# Altium schematic sheet 0_1_RevHis.SchDoc: Revision History
size A3; SheetNumber: 0.1
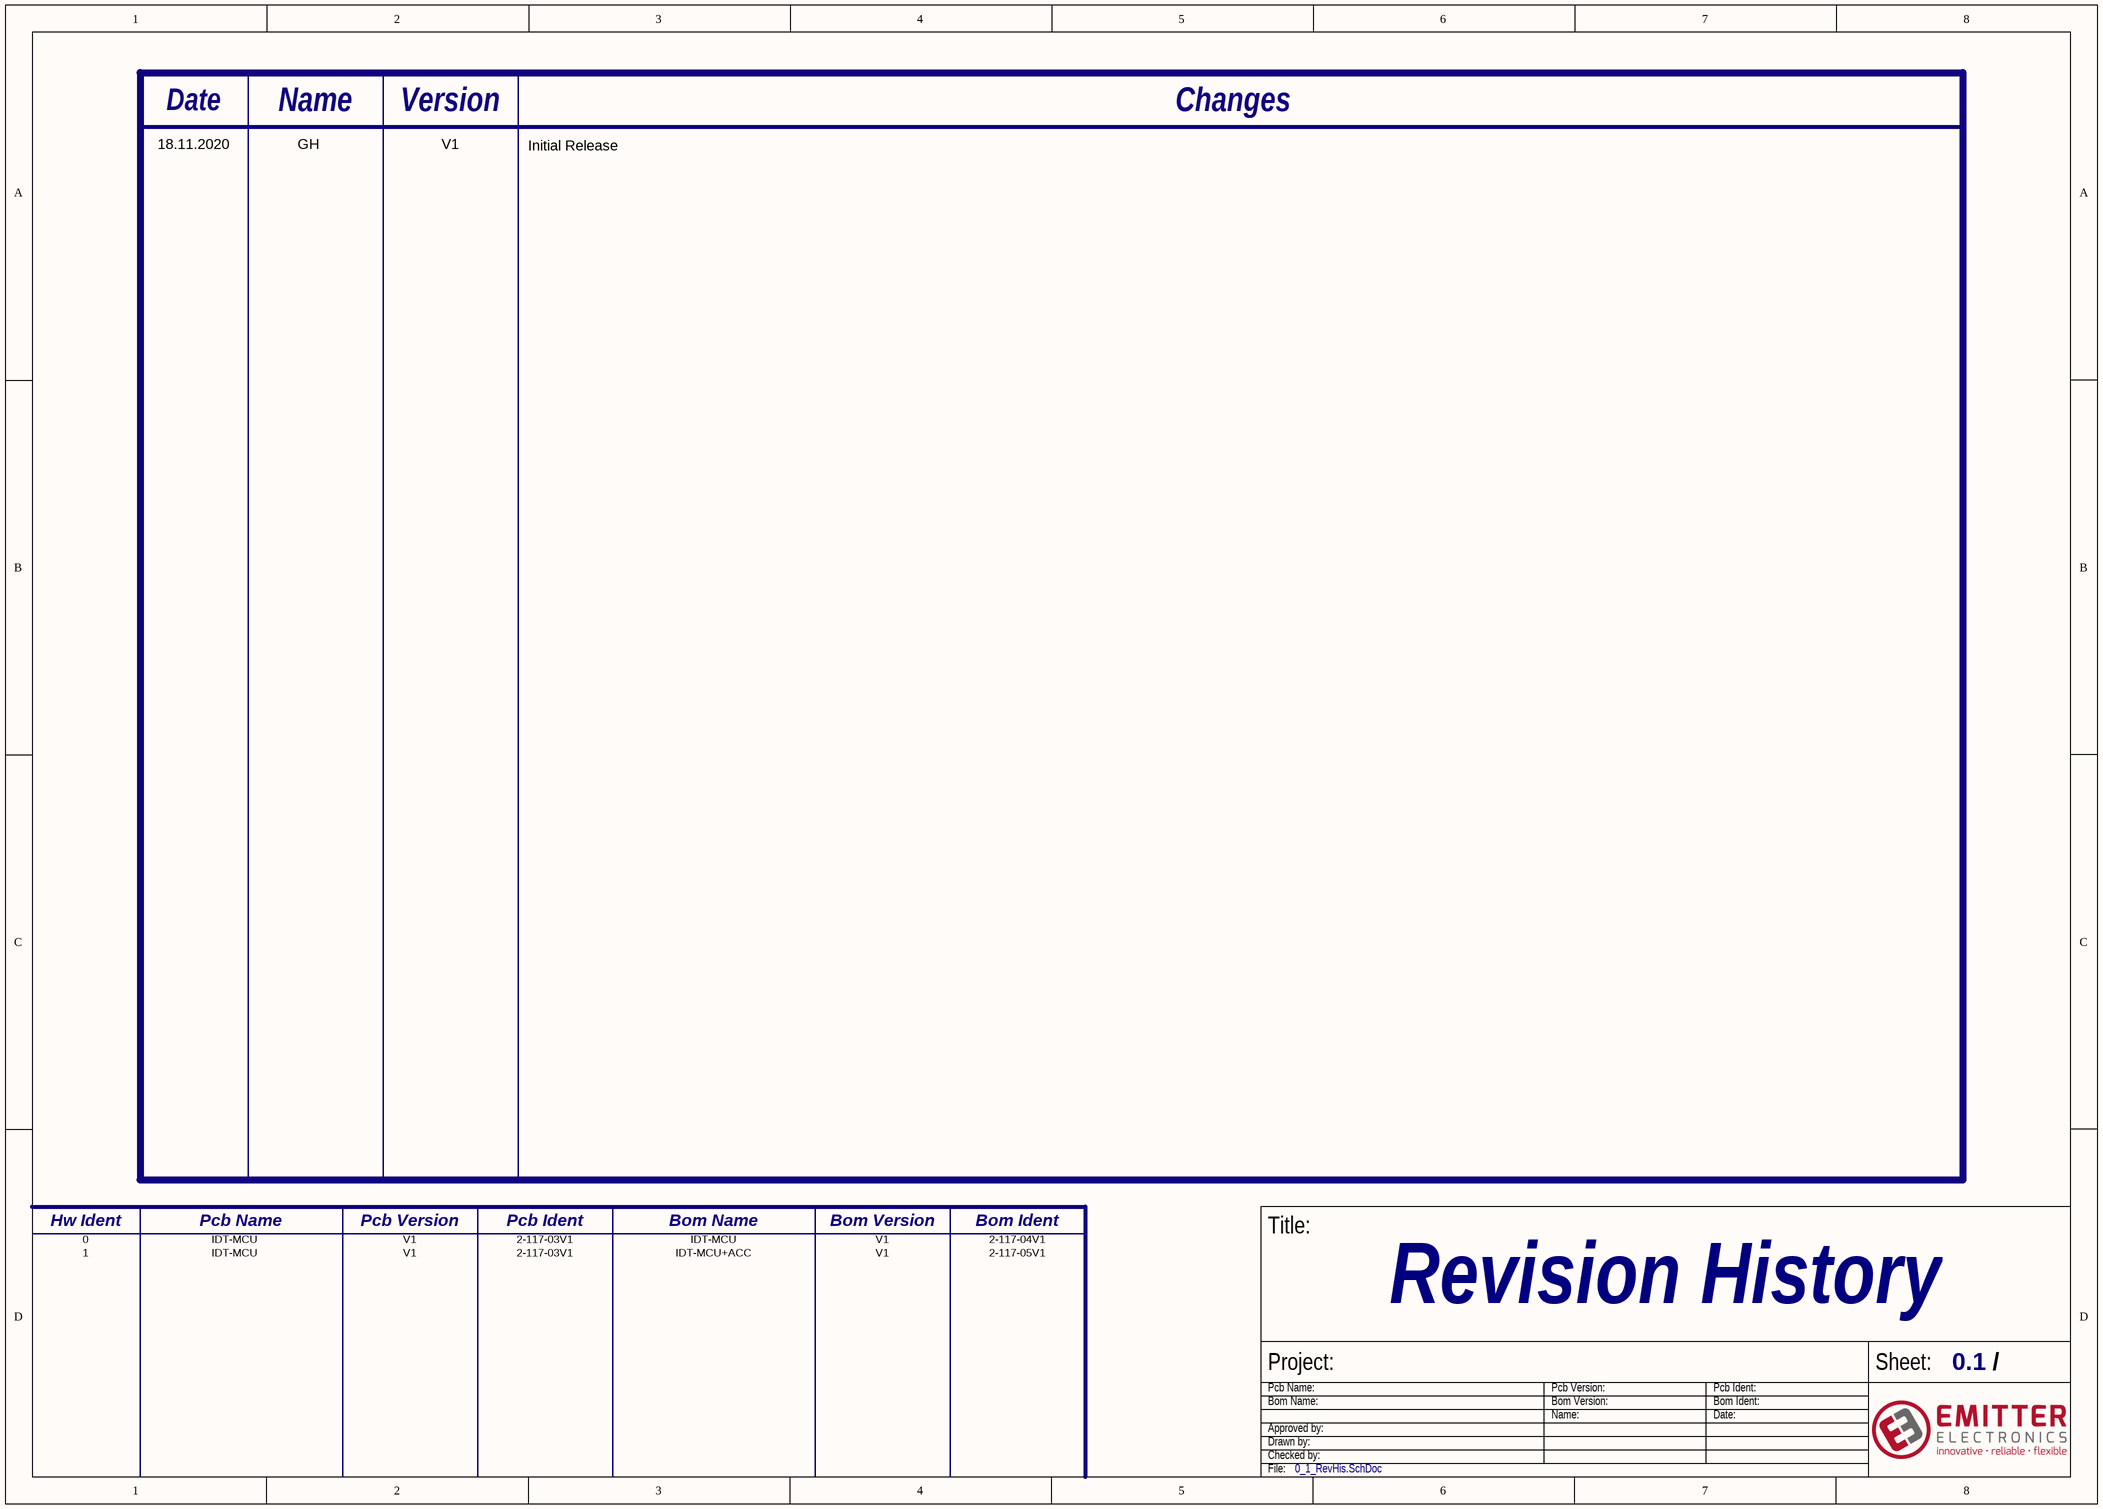
[diagram p0: 0_1_RevHis.SchDoc]

## Notes on the sheet
- Date
- Name
- Version
- Changes
- 18.11.2020
- GH
- V1
- Initial Release
- Hw Ident
- 0
- 1
- IDT-MCU
- Pcb Name
- Pcb Version
- Pcb Ident
- 2-117-03V1
- Bom Name
- IDT-MCU+ACC
- Bom Version
- Bom Ident
- 2-117-04V1
- 2-117-05V1
- Title:
- Project:
- Pcb Name:
- Pcb Version:
- Pcb Ident:
- Sheet:
- /
- Bom Name:
- Drawn by:
- Checked by:
- Approved by:
- Bom Version:
- Name:
- Bom Ident:
- Date:
- File: